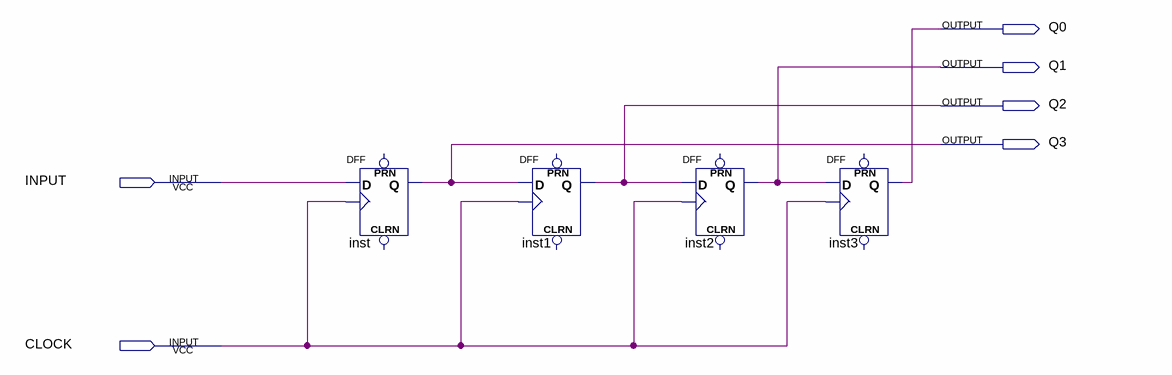
[diagram p0: schematic sheet]
// Quartus schematic ParaleloSerie.bdf as structural Verilog: 4 symbols, 6 pins
module ParaleloSerie (
  input  INPUT,
  input  CLOCK,
  output Q0,
  output Q1,
  output Q2,
  output Q3
);

  DFF inst (.CLK(CLOCK), .D(INPUT), .Q(Q3));  // open: CLRN, PRN
  DFF inst1 (.CLK(CLOCK), .D(Q3), .Q(Q2));  // open: CLRN, PRN
  DFF inst2 (.CLK(CLOCK), .D(Q2), .Q(Q1));  // open: CLRN, PRN
  DFF inst3 (.CLK(CLOCK), .D(Q1), .Q(Q0));  // open: CLRN, PRN
endmodule
